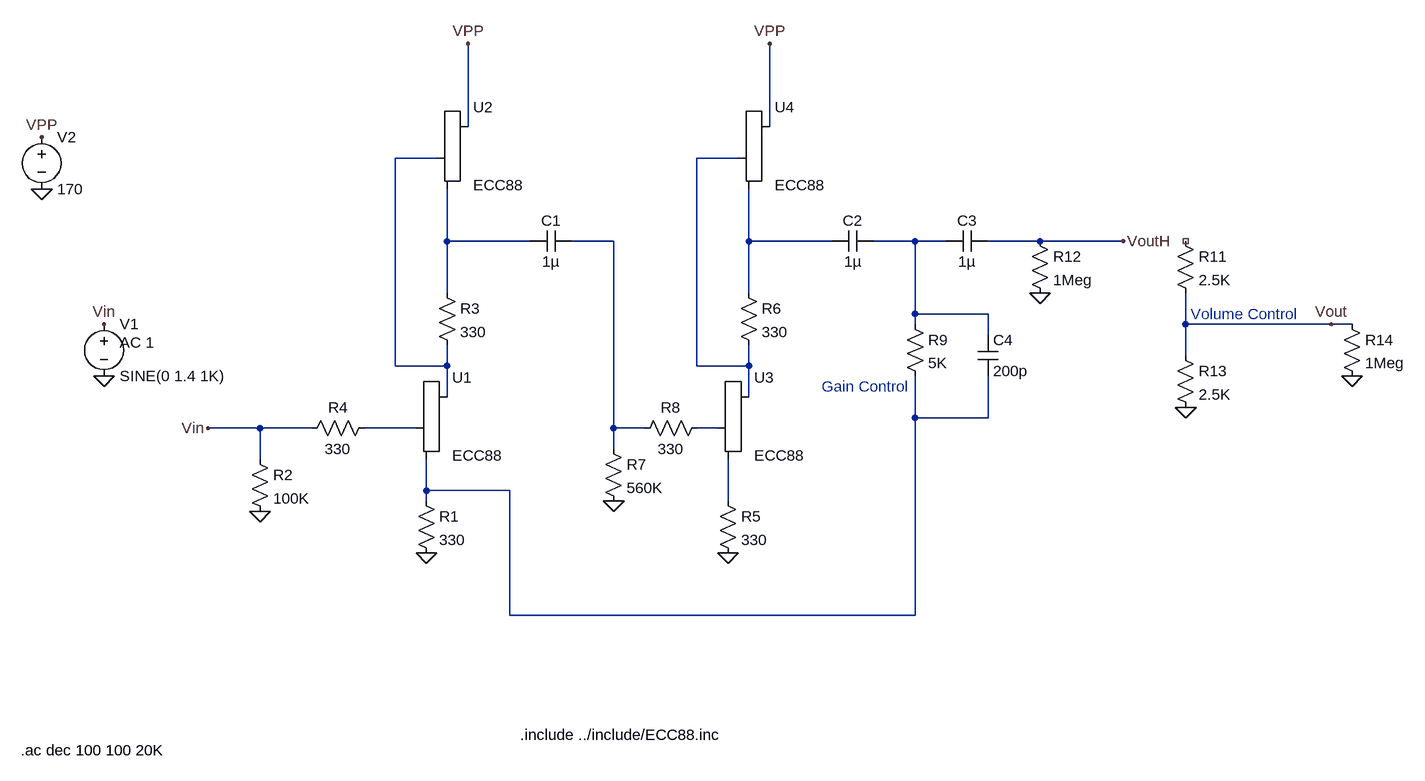
[diagram p0: schematic SRPPwithFeedback.asc]
SRPPwithFeedback.asc, the LTspice schematic file:
Version 4.1
SHEET 1 1352 680
WIRE -96 -736 -96 -864
WIRE 368 -736 368 -864
WIRE -144 -688 -208 -688
WIRE 320 -688 256 -688
WIRE -128 -560 -128 -640
WIRE 0 -560 -128 -560
WIRE 128 -560 64 -560
WIRE 336 -560 336 -640
WIRE 464 -560 336 -560
WIRE 592 -560 528 -560
WIRE 640 -560 592 -560
WIRE 784 -560 704 -560
WIRE 912 -560 784 -560
WIRE -128 -480 -128 -560
WIRE 336 -480 336 -560
WIRE 592 -448 592 -560
WIRE 704 -448 592 -448
WIRE 592 -432 592 -448
WIRE 1008 -432 1008 -480
WIRE 1232 -432 1008 -432
WIRE 1264 -432 1232 -432
WIRE 704 -416 704 -448
WIRE 1008 -384 1008 -432
WIRE -208 -368 -208 -688
WIRE -128 -368 -128 -400
WIRE -128 -368 -208 -368
WIRE 256 -368 256 -688
WIRE 336 -368 336 -400
WIRE 336 -368 256 -368
WIRE -128 -320 -128 -368
WIRE 336 -320 336 -368
WIRE 592 -288 592 -352
WIRE 704 -288 704 -352
WIRE 704 -288 592 -288
WIRE -416 -272 -496 -272
WIRE -336 -272 -416 -272
WIRE -176 -272 -256 -272
WIRE 128 -272 128 -560
WIRE 176 -272 128 -272
WIRE 288 -272 256 -272
WIRE 128 -240 128 -272
WIRE -416 -224 -416 -272
WIRE -160 -176 -160 -224
WIRE -32 -176 -160 -176
WIRE -160 -160 -160 -176
WIRE 304 -160 304 -224
WIRE -32 16 -32 -176
WIRE 592 16 592 -288
WIRE 592 16 -32 16
FLAG -160 -80 0
FLAG -416 -144 0
FLAG -656 -352 0
FLAG -656 -432 Vin
FLAG -752 -640 0
FLAG -752 -720 VPP
FLAG -96 -864 VPP
FLAG 304 -80 0
FLAG 368 -864 VPP
FLAG 128 -160 0
FLAG 784 -480 0
FLAG 912 -560 VoutH
FLAG 1008 -304 0
FLAG 1264 -352 0
FLAG 1232 -432 Vout
FLAG -496 -272 Vin
SYMBOL Misc\\triode -128 -272 R0
SYMATTR InstName U1
SYMATTR Value ECC88
SYMBOL res -176 -176 R0
SYMATTR InstName R1
SYMATTR Value 330
SYMBOL res -432 -240 R0
SYMATTR InstName R2
SYMATTR Value 100K
SYMBOL cap 64 -576 R90
WINDOW 0 0 32 VBottom 2
WINDOW 3 32 32 VTop 2
SYMATTR InstName C1
SYMATTR Value 1µ
SYMBOL voltage -656 -448 R0
WINDOW 123 24 44 Left 2
WINDOW 39 0 0 Left 0
SYMATTR Value2 AC 1
SYMATTR InstName V1
SYMATTR Value SINE(0 1.4 1K)
SYMBOL voltage -752 -736 R0
WINDOW 123 0 0 Left 0
WINDOW 39 0 0 Left 0
SYMATTR InstName V2
SYMATTR Value 170
SYMBOL Misc\\triode -96 -688 R0
SYMATTR InstName U2
SYMATTR Value ECC88
SYMBOL res -144 -496 R0
SYMATTR InstName R3
SYMATTR Value 330
SYMBOL res -240 -288 R90
WINDOW 0 0 56 VBottom 2
WINDOW 3 32 56 VTop 2
SYMATTR InstName R4
SYMATTR Value 330
SYMBOL Misc\\triode 336 -272 R0
SYMATTR InstName U3
SYMATTR Value ECC88
SYMBOL res 288 -176 R0
SYMATTR InstName R5
SYMATTR Value 330
SYMBOL cap 528 -576 R90
WINDOW 0 0 32 VBottom 2
WINDOW 3 32 32 VTop 2
SYMATTR InstName C2
SYMATTR Value 1µ
SYMBOL Misc\\triode 368 -688 R0
SYMATTR InstName U4
SYMATTR Value ECC88
SYMBOL res 320 -496 R0
SYMATTR InstName R6
SYMATTR Value 330
SYMBOL res 112 -256 R0
SYMATTR InstName R7
SYMATTR Value 560K
SYMBOL res 272 -288 R90
WINDOW 0 0 56 VBottom 2
WINDOW 3 32 56 VTop 2
SYMATTR InstName R8
SYMATTR Value 330
SYMBOL cap 704 -576 R90
WINDOW 0 0 32 VBottom 2
WINDOW 3 32 32 VTop 2
SYMATTR InstName C3
SYMATTR Value 1µ
SYMBOL res 576 -448 R0
SYMATTR InstName R9
SYMATTR Value 5K
SYMBOL cap 688 -416 R0
SYMATTR InstName C4
SYMATTR Value 200p
SYMBOL res 768 -576 R0
SYMATTR InstName R12
SYMATTR Value 1Meg
SYMBOL res 992 -576 R0
SYMATTR InstName R11
SYMATTR Value 2.5K
SYMBOL res 992 -400 R0
SYMATTR InstName R13
SYMATTR Value 2.5K
SYMBOL res 1248 -448 R0
SYMATTR InstName R14
SYMATTR Value 1Meg
TEXT -16 200 Left 2 !.include ../include/ECC88.inc
TEXT 1016 -448 Left 2 ;Volume Control
TEXT 448 -336 Left 2 ;Gain Control
TEXT -784 224 Left 2 !.ac dec 100 100 20K

The netlist it stands for:
* SRPPwithFeedback.asc
X§U1 N001 N008 N007 ECC88
R1 N007 0 330
R2 Vin 0 100K
C1 N004 N003 1µ
V1 Vin 0 SINE(0 1.4 1K) AC 1
V2 VPP 0 170
X§U2 VPP N001 N003 ECC88
R3 N003 N001 330
R4 N008 Vin 330
X§U3 N002 N009 N010 ECC88
R5 N010 0 330
C2 N006 N005 1µ
X§U4 VPP N002 N005 ECC88
R6 N005 N002 330
R7 N004 0 560K
R8 N009 N004 330
C3 VoutH N006 1µ
R9 N006 N007 5K
C4 N006 N007 200p
R12 VoutH 0 1Meg
R11 NC_01 Vout 2.5K
R13 Vout 0 2.5K
R14 Vout 0 1Meg
.include ../include/ECC88.inc
* Volume Control
* Gain Control
.ac dec 100 100 20K
.backanno
.end